# Altium schematic sheet Memory.SchDoc: Microcontroller
size A3; DrawnBy: James Chen; Revision: 1.0; SheetNumber: 2; SheetTotal: 5
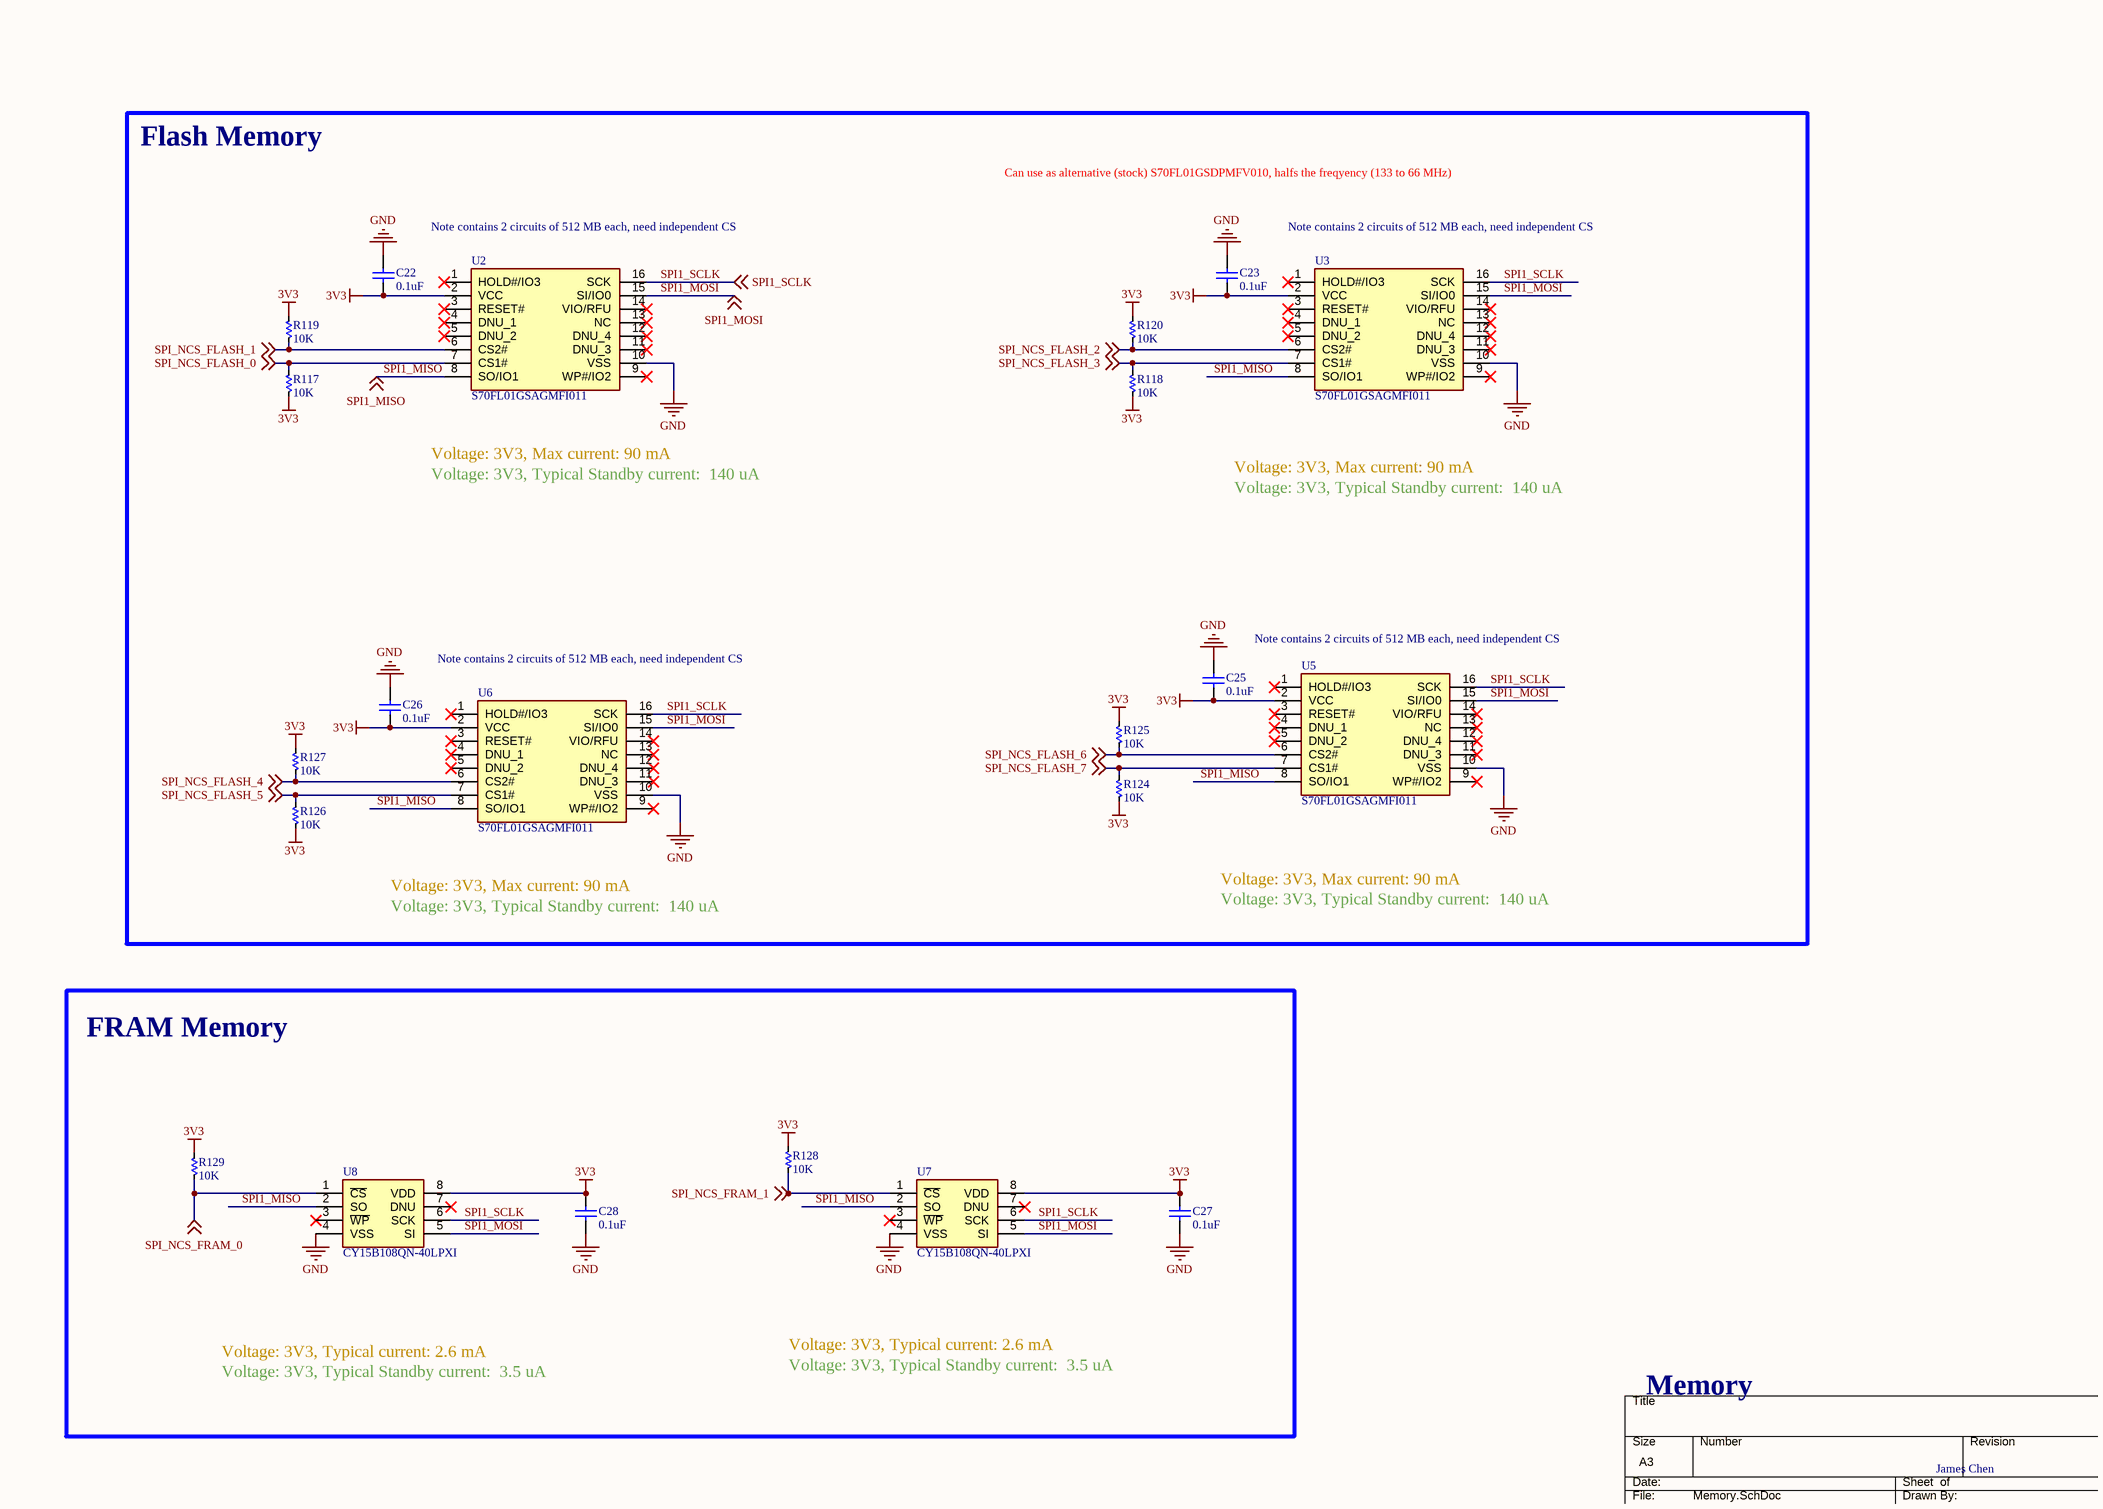
[diagram p0: Memory.SchDoc]

## Parts
C22  0.1uF  [0603]
C23  0.1uF  [0603]
C25  0.1uF  [0603]
C26  0.1uF  [0603]
C27  0.1uF  [0603]
C28  0.1uF  [0603]
R117  10K  [0603]
R118  10K  [0603]
R119  10K  [0603]
R120  10K  [0603]
R124  10K  [0603]
R125  10K  [0603]
R126  10K  [0603]
R127  10K  [0603]
R128  10K  [0603]
R129  10K  [0603]
U2  S70FL01GSAGMFI011  [U-S70FL01GSAGMFI011]
U3  S70FL01GSAGMFI011  [U-S70FL01GSAGMFI011]
U5  S70FL01GSAGMFI011  [U-S70FL01GSAGMFI011]
U6  S70FL01GSAGMFI011  [U-S70FL01GSAGMFI011]
U7  CY15B108QN-40LPXI  [U-CY15B108QN-40LPXI]
U8  CY15B108QN-40LPXI  [U-CY15B108QN-40LPXI]

## Blocks framed on the sheet
Flash Memory: C22 C23 C25 C26 R117-R120 R124-R127 U2 U3 U5 U6
FRAM Memory: C27 C28 R128 R129 U7 U8

## Nets
3V3: C22.1 C23.1 C25.1 C26.1 C27.1 C28.1 R117.1 R118.1 R119.1 R120.2 R124.1 R125.2 R126.1 R127.2 R128.1 R129.1 U2.2(VCC) U3.2(VCC) U5.2(VCC) U6.2(VCC) U7.8(VDD) U8.8(VDD)
GND: C22.2 C23.2 C25.2 C26.2 C27.2 C28.2 U2.10(VSS) U3.10(VSS) U5.10(VSS) U6.10(VSS) U7.4(VSS) U8.4(VSS)
SPI1_MISO: U2.8(SO/IO1) U3.8(SO/IO1) U5.8(SO/IO1) U6.8(SO/IO1) U7.2(SO) U8.2(SO) ; off-sheet SPI1_MISO
SPI1_MOSI: U2.15(SI/IO0) U3.15(SI/IO0) U5.15(SI/IO0) U6.15(SI/IO0) U7.5(SI) U8.5(SI) ; off-sheet SPI1_MOSI
SPI1_SCLK: U2.16(SCK) U3.16(SCK) U5.16(SCK) U6.16(SCK) U7.6(SCK) U8.6(SCK) ; off-sheet SPI1_SCLK
SPI_NCS_FLASH_0: R117.2 U2.7(CS1#) ; off-sheet SPI_NCS_FLASH_0
SPI_NCS_FLASH_1: R119.2 U2.6(CS2#) ; off-sheet SPI_NCS_FLASH_1
SPI_NCS_FLASH_2: R120.1 U3.6(CS2#) ; off-sheet SPI_NCS_FLASH_2
SPI_NCS_FLASH_3: R118.2 U3.7(CS1#) ; off-sheet SPI_NCS_FLASH_3
SPI_NCS_FLASH_4: R127.1 U6.6(CS2#) ; off-sheet SPI_NCS_FLASH_4
SPI_NCS_FLASH_5: R126.2 U6.7(CS1#) ; off-sheet SPI_NCS_FLASH_5
SPI_NCS_FLASH_6: R125.1 U5.6(CS2#) ; off-sheet SPI_NCS_FLASH_6
SPI_NCS_FLASH_7: R124.2 U5.7(CS1#) ; off-sheet SPI_NCS_FLASH_7
SPI_NCS_FRAM_0: R129.2 U8.1(~{CS}) ; off-sheet SPI_NCS_FRAM_0
SPI_NCS_FRAM_1: R128.2 U7.1(~{CS}) ; off-sheet SPI_NCS_FRAM_1

Not connected (* = marked no-connect by the designer): U2 1(HOLD#/IO3)* 3(RESET#)* 4(DNU_1)* 5(DNU_2)* 9(WP#/IO2)* 11(DNU_3)* 12(DNU_4)* 13(NC)* 14(VIO/RFU)*; U3 1(HOLD#/IO3)* 3(RESET#)* 4(DNU_1)* 5(DNU_2)* 9(WP#/IO2)* 11(DNU_3)* 12(DNU_4)* 13(NC)* 14(VIO/RFU)*; U5 1(HOLD#/IO3)* 3(RESET#)* 4(DNU_1)* 5(DNU_2)* 9(WP#/IO2)* 11(DNU_3)* 12(DNU_4)* 13(NC)* 14(VIO/RFU)*; U6 1(HOLD#/IO3)* 3(RESET#)* 4(DNU_1)* 5(DNU_2)* 9(WP#/IO2)* 11(DNU_3)* 12(DNU_4)* 13(NC)* 14(VIO/RFU)*; U7 3(~{WP})* 7(DNU)*; U8 3(~{WP})* 7(DNU)*

## Notes on the sheet
- Can use as alternative (stock) S70FL01GSDPMFV010, halfs the freqyency (133 to 66 MHz)
- Note contains 2 circuits of 512 MB each, need independent CS
- Voltage: 3V3, Max current: 90 mA
- Voltage: 3V3, Typical Standby current:  140 uA
- Voltage: 3V3, Typical current: 2.6 mA
- Voltage: 3V3, Typical Standby current:  3.5 uA
- Memory
- James Chen
- DWG NO:
- REV:
- THIS DOCUMENT AND THE DATA DISCLOSED HEREIN OR
- HEREWITH IS THE PROPERTY OF ALTIUM LIMITED AND MAY
- BE FREELY DISTRIBUTED IN WHOLE. NO RIGHTS ARE
- RESERVED OR EXPRESS OR IMPLIED WARANTEE GIVEN.
- REVISION
- DESCRIPTION
- DATE
- APPROVED
- ENG:
- APPROVALS
- PROJECT
- DSN:
- CHK:
- REFERENCE DOCUMENTS
- PROJECT REVISION:
- TITLE
- DOCUMENT REVISION:
- DESIGN ITEM:
- BOM:
- FAB DWG:
- PCB DWG:
- ASSY DWG:
- SCALE:
- A2
- SIZE
- CAGE CODE
- FILE NAME
- DWG NO.
- SHEET
- OF
- REV

## Library data of the parts
C22 C23 C25-C28 = CC-104-K-25V-X7R-0603: 0.1 µF ±10% 25V Ceramic Capacitor X7R 0603 (1608 Metric); Manufacturer: Samsung Electro-Mechanics; Manufacturer Part #: CL10B104KA8NNNC; ComponentLink1description: Datasheet; ComponentLink1URL: https://ds.yuden.co.jp/TYCOMPAS/ut/detail?pn=TMK105BJ104KV-F%20%20&u=M; ComponentLink2description: Manufacturer Website; Distributor: Digikey; Distributor Part #: 1276-1006-1-ND; Part Description: 0.1 µF ±10% 25V Ceramic Capacitor X7R 0603 (1608 Metric); ComponentLink2URL: https://www.yuden.co.jp/or/; Value: 0.1uF
R117-R120 R124-R129 = RT-10K0-F-1/16W-0603: 10 kOhms ±0.1% 0.063W, 1/16W Chip Resistor 0603 (1608 Metric) - Thin Film; Manufacturer: TE Connectivity Passive Product; Manufacturer Part #: CPF0603B10KE; ComponentLink1description: Datasheet; ComponentLink1URL: https://www.vishay.com/docs/20035/dcrcwe3.pdf; ComponentLink2description: Manufacturer Website; Distributor: Digikey; Distributor Part #: A119886CT-ND; Part Description: 10 kOhms ±0.1% 0.063W, 1/16W Chip Resistor 0603 (1608 Metric) - Thin Film; ComponentLink2URL: https://www.vishay.com/; Value: 10K
U2 U3 U5 U6 = U-S70FL01GSAGMFI011: IC FLASH 1GBIT SPI/QUAD 16SOIC; Manufacturer: Cypress Semiconductor; Distributor: Digikey; Distributor Part #: 1274-1092-ND; Manufacturer Part #: S70FL01GSAGMFI011
U7 U8 = U-CY15B108QN-40LPXI: IC FRAM 8MBIT SPI 40MHZ 8GQFN; Manufacturer: Cypress Semiconductor; Manufacturer Part #: CY15B108QN-40LPXI; Distributor: Digikey; Distributor Part #: 428-4723-ND